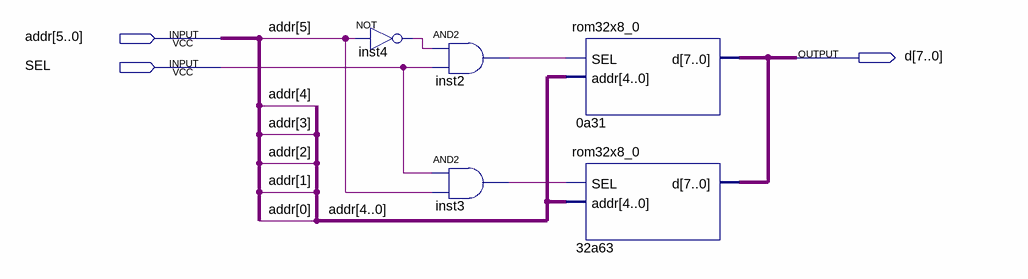
[diagram p0: schematic sheet]
// Quartus schematic rom64x8_0.bdf as structural Verilog: 5 symbols, 3 pins
module rom64x8_0 (
  input  [5:0] addr,
  input  SEL,
  output [7:0] d
);

  wire inst2_out, inst3_out, inst4_out;

  not inst4 (inst4_out, addr[5]);
  and inst2 (inst2_out, inst4_out, SEL);
  and inst3 (inst3_out, SEL, addr[5]);
  rom32x8_0 u_0a31 (.addr(addr[4:0]), .SEL(inst2_out), .d(d));
  rom32x8_0 u_32a63 (.addr(addr[4:0]), .SEL(inst3_out), .d(d));
endmodule
